# Altium project Control_Motor.PrjPcb
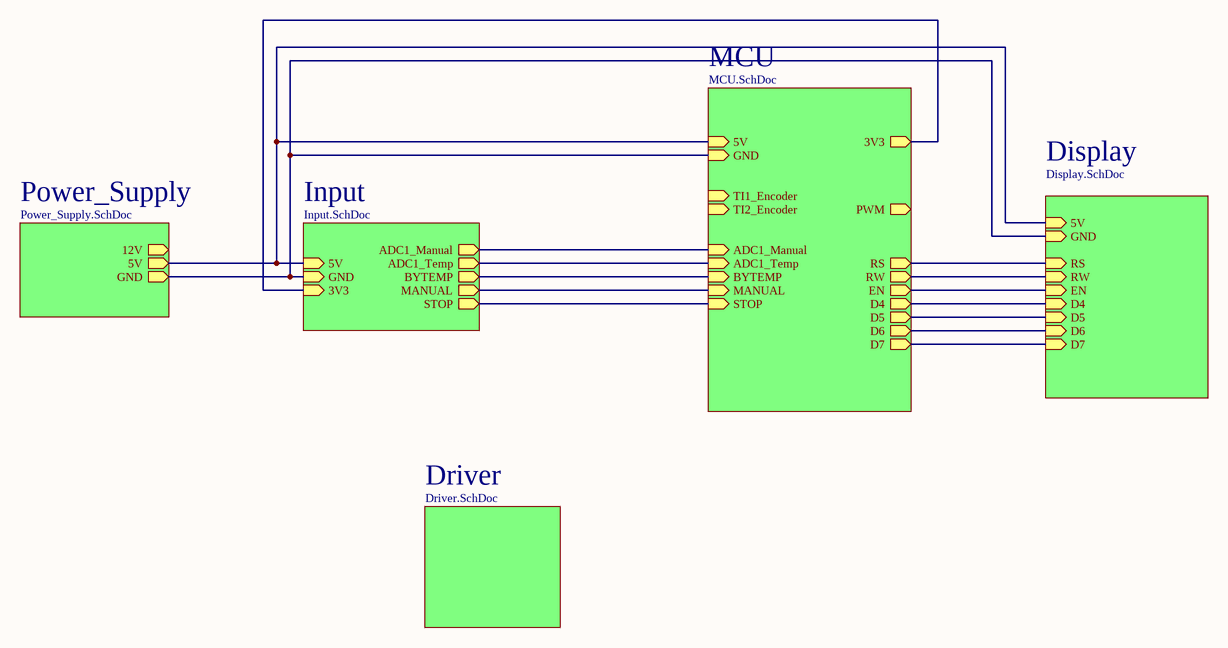
[diagram p0: Control_Motor.SchDoc]
6 sheets, 32 parts. Net scope: hierarchical (ports join the sheet entries above them; power ports are global).
Sheets:
  Control_Motor.SchDoc
    Power_Supply = Power_Supply.SchDoc
    Input = Input.SchDoc
    MCU = MCU.SchDoc
    Display = Display.SchDoc
    Driver = Driver.SchDoc

## Sheet Control_Motor.SchDoc: Control_Motor
size A4; SheetNumber: 1; SheetTotal: 6

### Sub-sheets
Display = Display.SchDoc: 5V (in), GND (in), RS (in), RW (in), EN (in), D4 (in), D5 (in), D6 (in), D7 (in)
Driver = Driver.SchDoc: no entries
Input = Input.SchDoc: 5V (in), GND (in), ADC1_Temp (out), BYTEMP (out), MANUAL (out), STOP (out), 3V3 (in), ADC1_Manual (out)
MCU = MCU.SchDoc: 5V (in), GND (in), TI1_Encoder (in), BYTEMP (in), TI2_Encoder (in), MANUAL (in), ADC1_Temp (in), STOP (in), ADC1_Manual (in), PWM (out), RS (out), RW (out), EN (out), D5 (out), D4 (out), D6 (out), D7 (out), 3V3 (out)
Power_Supply = Power_Supply.SchDoc: 12V (out), GND (out), 5V (out)

### Nets
3V3: sheet Input/3V3, sheet MCU/3V3
5V: sheet Power_Supply/5V, sheet Input/5V, sheet MCU/5V, sheet Display/5V
GND: sheet Power_Supply/GND, sheet Input/GND, sheet MCU/GND, sheet Display/GND
NetC?#5_2: sheet Input/BYTEMP, sheet MCU/BYTEMP
NetC?#6_2: sheet Input/MANUAL, sheet MCU/MANUAL
NetC?#7_2: sheet Input/STOP, sheet MCU/STOP
NetLCD?_4: sheet MCU/RS, sheet Display/RS
NetLCD?_5: sheet MCU/RW, sheet Display/RW
NetLCD?_6: sheet MCU/EN, sheet Display/EN
NetLCD?_11: sheet MCU/D4, sheet Display/D4
NetLCD?_12: sheet MCU/D5, sheet Display/D5
NetLCD?_13: sheet MCU/D6, sheet Display/D6
NetLCD?_14: sheet MCU/D7, sheet Display/D7
NetR?#2_2: sheet Input/ADC1_Temp, sheet MCU/ADC1_Temp
NetU*_29: sheet Input/ADC1_Manual, sheet MCU/ADC1_Manual

### Notes on the sheet
- Document Title:
- ĐH BKHN
- Project Name:
- Size:
- A4
- Reviewer:
- Designer:
- Nguyen Ba Hoang
- Revision:
- 1 Dai Co Viet Street
- Bach Khoa, Hai Ba Trung
- Ha Noi
- File:
- Sheet:
- of
- Date:

## Sheet Power_Supply.SchDoc: Power_Supply
size A4; SheetNumber: 2; SheetTotal: 5
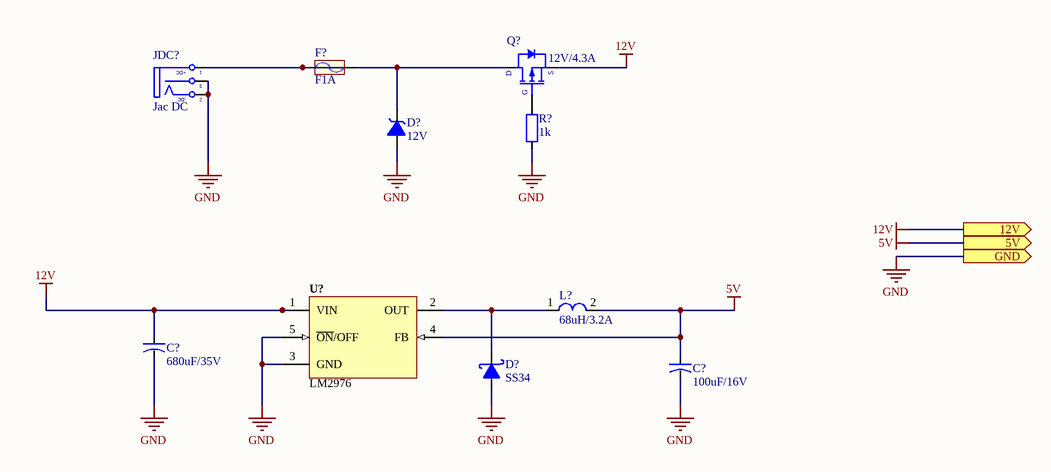
[diagram p1: Power_Supply.SchDoc]

### Parts
(Parts that share a designator on the sheet are numbered #1, #2 ... from top to bottom, then left to right.)
C?#1  680uF/35V  [CAP-ALU-SMD-H]
C?#2  100uF/16V  [CAP-ALU-SMD-6.3x7.7x2.2]
D?#1  12V  [SMA]
D?#2  SS34  [SMA]
F?  F1A  [RES-SMD-1812]
JDC?  Jac DC  [DC-IN]
L?  68uH/3.2A  [L-SMD-M-12x10]
Q?#1  12V/4.3A  [SOT23]
R?#1  1k  [RES-SMD-0805]
U?#1  LM2976  [TO263-5]

### Ports
5V (out), 12V (out), GND (out)

### Nets
5V: C?#2.1 L?.2 U?#1.4(FB) ; port 5V
12V: C?#1.1 Q?#1.3(S) U?#1.1(VIN) ; port 12V
GND: C?#1.2 C?#2.2 D?#1.1(A) D?#2.1(A) JDC?.2(TN) JDC?.3(S) R?#1.1 U?#1.3(GND) U?#1.5(~{ON}/OFF) ; port GND
NetD?#1_2: D?#1.2(K) F?.2 Q?#1.2(D)
NetD?#2_2: D?#2.2(K) L?.1 U?#1.2(OUT)
NetF?_1: F?.1 JDC?.1(T)
NetQ?#1_1: Q?#1.1(G) R?#1.2

### Notes on the sheet
- Document Title:
- ĐH BKHN
- Project Name:
- Size:
- A4
- Reviewer:
- Designer:
- Nguyen Ba Hoang
- Revision:
- 1 Dai Co Viet Street
- Bach Khoa, Hai Ba Trung
- Ha Noi
- File:
- Sheet:
- of
- Date:
- (in symbol DCIN) +DC; -DC

### Library data of the parts
C?#1 C?#2 = CAP-ALU-SMD: Polarized Capacitor (Axial)
  C?#1: Supplier: Thegioiic; Supplier Part Num: Tụ Nhôm SMD 680uF 35V 12.5x13.5mm
  C?#2: Published: 8-Jun-2000; LatestRevisionDate: 17-Jul-2002; LatestRevisionNote: Re-released for DXP Platform.; PackageReference: POLAR0.8; Publisher: Altium Limited
D?#1 = DZ: Diode TVS; Supplier: Thegioiic; Supplier Part Num: SMAJ12A
D?#2 = 1N5822: Schottky Rectifiers; Supplier: Thegioiic; Supplier Part Num: SS34 SMA Diode Schottky 3A
F? = Fuse: Supplier: Thegioiic; Supplier Part Num: MF-MSMF250/16 Cầu Chì Tự Phục Hồi 1812 16V 2.5A
JDC? = DCIN: Jac DC input; Available: *
L? = L-SMD-1: ComponentLink1Description: Manufacturer; ComponentLink1URL: http://www.we-online.de; ComponentLink2Description: Datasheet; ComponentLink2URL: http://katalog.we-online.de/pbs/datasheet/78477010.pdf; Supplier: Thegioiic; Supplier Part Num: Cuộn Cảm Dán SMD 1280-680 68uH 3.2A
Q?#1 = IRLML6401TRPBF: Supplier: Thegioiic; Supplier Part Num: IRLML6401TRPBF
R?#1 = Resistor - SMD: Resistor; Manufacturer: Generic Components; Class: Passive; Published: 08/06/2000; Publisher: Altium Hobart Technology Centre
U?#1 = LM2596: Supplier: Thegioiic; Supplier Part Num: LM2596S-5.0 IC Điều Chỉnh Giảm Áp 5V 3A TO-263-5

## Sheet Input.SchDoc: Input
size A4; SheetNumber: 3; SheetTotal: 5
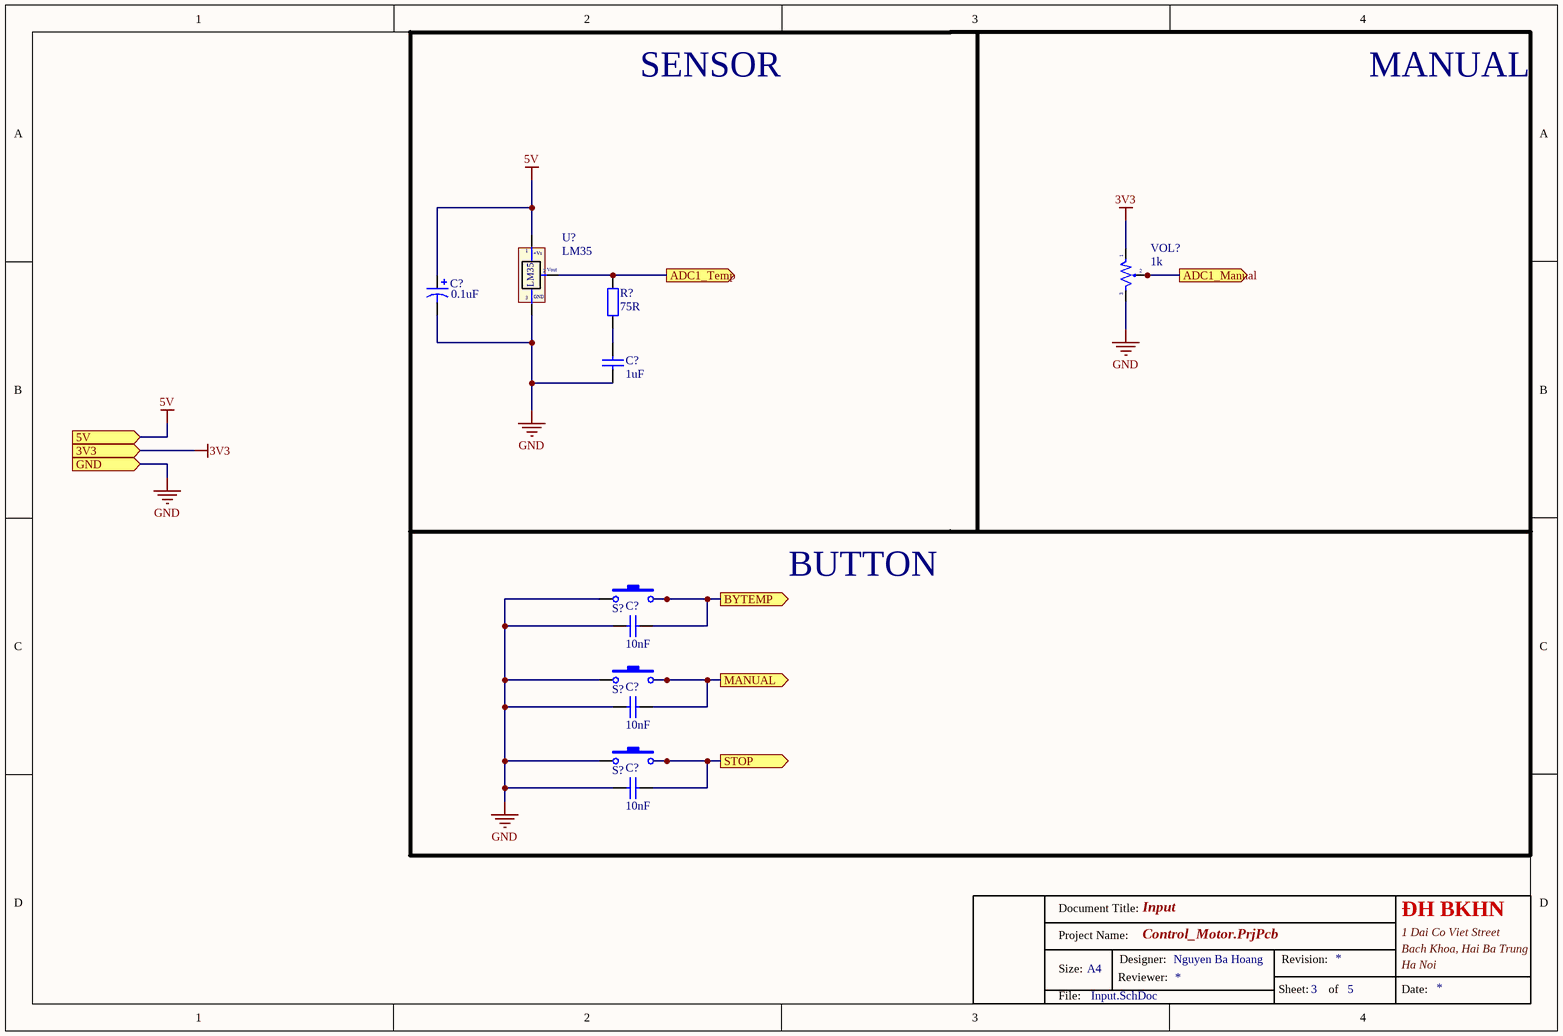
[diagram p2: Input.SchDoc]

### Parts
(Parts that share a designator on the sheet are numbered #1, #2 ... from top to bottom, then left to right.)
C?#3  0.1uF  [CAP-ALU-SMD-C]
C?#4  1uF  [CAP_0805]
C?#5  10nF  [CAP_0805]
C?#6  10nF  [CAP_0805]
C?#7  10nF  [CAP_0805]
R?#2  75R  [RES-SMD-0805]
S?#1  SW-SMD  [SW-SMD]  (value not drawn)
S?#2  SW-SMD  [SW-SMD]  (value not drawn)
S?#3  SW-SMD  [SW-SMD]  (value not drawn)
U?#2  LM35  [QTO-92]
VOL?  1k  [VOL_1]

### Ports
3V3 (in), 5V (in), ADC1_Manual (out), ADC1_Temp (out), BYTEMP (out), GND (in), MANUAL (out), STOP (out)

### Nets
3V3: VOL?.1 ; port 3V3
5V: C?#3.1 U?#2.1(+Vs) ; port 5V
GND: C?#3.2 C?#4.1 C?#5.1 C?#6.1 C?#7.1 S?#1.2 S?#2.2 S?#3.2 U?#2.3(-) VOL?.3 ; port GND
NetC?#4_2: C?#4.2 R?#2.1
NetC?#5_2: C?#5.2 S?#1.1 ; port BYTEMP
NetC?#6_2: C?#6.2 S?#2.1 ; port MANUAL
NetC?#7_2: C?#7.2 S?#3.1 ; port STOP
NetR?#2_2: R?#2.2 U?#2.2(Vout) ; port ADC1_Temp
NetU*_29: VOL?.2 ; port ADC1_Manual

### Notes on the sheet
- SENSOR
- MANUAL
- BUTTON
- Document Title:
- ĐH BKHN
- Project Name:
- Size:
- A4
- Reviewer:
- Designer:
- Nguyen Ba Hoang
- Revision:
- 1 Dai Co Viet Street
- Bach Khoa, Hai Ba Trung
- Ha Noi
- File:
- Sheet:
- of
- Date:
- (in symbol LM35) GND

### Library data of the parts
C?#3 = Cap Pol 5mm: Polarized Capacitor (Axial); Supplier: Thegioiic; Supplier Part Num: Tụ Nhôm SMD 0.1uF 50V 4x5.4mm
C?#4-C?#7 = CAP 102 2KV: Capacitor (Semiconductor SIM Model); Supplier: Thegioiic
  C?#4: Supplier Part Num: Tụ Gốm 0805 1uF 16V
  C?#5-C?#7: Supplier Part Num: Tụ Gốm 0805 10nF 50V
R?#2 = R1/4W: Resistor 1/4W; Supplier: Thegioiic; Supplier Part Num: Điện Trở 75 Ohm 0805 5%
S?#1-S?#3 = SW-SMD: Switch; Supplier: Thegioiic; Supplier Part Num: Nút Nhấn 3x6mm Cao 2.5mm 2 Chân SMD Đầu Trắng
U?#2 = LM35: Teminal; Available: *
VOL? = VOL-S: Var Resistor; Supplier: Thegioiic; Supplier Part Num: WH148-3P-102 Biến Trở Volume Đơn 1 KOhm 20% 0.125W 3 Chân

## Sheet MCU.SchDoc: MCU
size A4; SheetNumber: 4; SheetTotal: 6
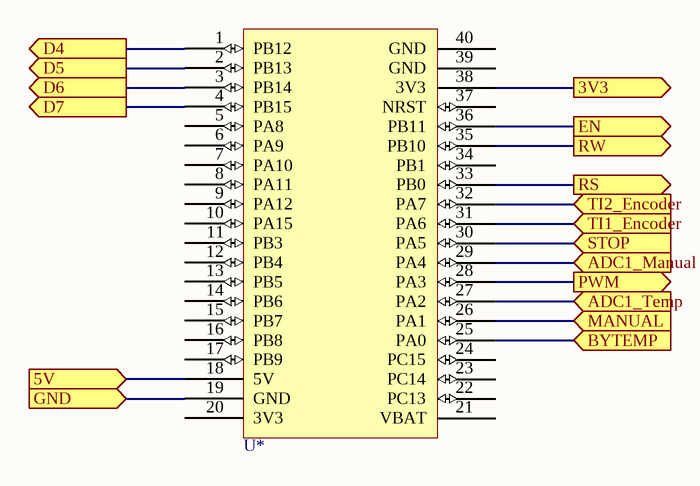
[diagram p3: MCU.SchDoc]

### Parts
U*  STM32 BluePill  [STM32 Bluepill]  (value not drawn)

### Ports
3V3 (out), 5V (in), ADC1_Manual (in), ADC1_Temp (in), BYTEMP (in), D4 (out), D5 (out), D6 (out), D7 (out), EN (out), GND (in), MANUAL (in), PWM (out), RS (out), RW (out), STOP (in), TI1_Encoder (in), TI2_Encoder (in)

### Nets
3V3: U*.38(3V3) ; port 3V3
5V: U*.18(5V) ; port 5V
GND: U*.19(GND) ; port GND
NetC?#5_2: U*.25(PA0) ; port BYTEMP
NetC?#6_2: U*.26(PA1) ; port MANUAL
NetC?#7_2: U*.30(PA5) ; port STOP
NetLCD?_4: U*.33(PB0) ; port RS
NetLCD?_5: U*.35(PB10) ; port RW
NetLCD?_6: U*.36(PB11) ; port EN
NetLCD?_11: U*.1(PB12) ; port D4
NetLCD?_12: U*.2(PB13) ; port D5
NetLCD?_13: U*.3(PB14) ; port D6
NetLCD?_14: U*.4(PB15) ; port D7
NetR?#2_2: U*.27(PA2) ; port ADC1_Temp
NetU*_28: U*.28(PA3) ; port PWM
NetU*_29: U*.29(PA4) ; port ADC1_Manual
NetU*_31: U*.31(PA6) ; port TI1_Encoder
NetU*_32: U*.32(PA7) ; port TI2_Encoder

Not connected (* = marked no-connect by the designer): U* 5(PA8) 6(PA9) 7(PA10) 8(PA11) 9(PA12) 10(PA15) 11(PB3) 12(PB4) 13(PB5) 14(PB6) 15(PB7) 16(PB8) 17(PB9) 20(3V3) 21(VBAT) 22(PC13) 23(PC14) 24(PC15) 34(PB1) 37(NRST) 39(GND) 40(GND)

### Notes on the sheet
- Document Title:
- ĐH BKHN
- Project Name:
- Size:
- A4
- Reviewer:
- Designer:
- Nguyen Ba Hoang
- Revision:
- 1 Dai Co Viet Street
- Bach Khoa, Hai Ba Trung
- Ha Noi
- File:
- Sheet:
- of
- Date:

### Library data of the parts
U* = STM32 BluePill: Available: *

## Sheet Display.SchDoc: Display
size A4; SheetNumber: 5; SheetTotal: 5
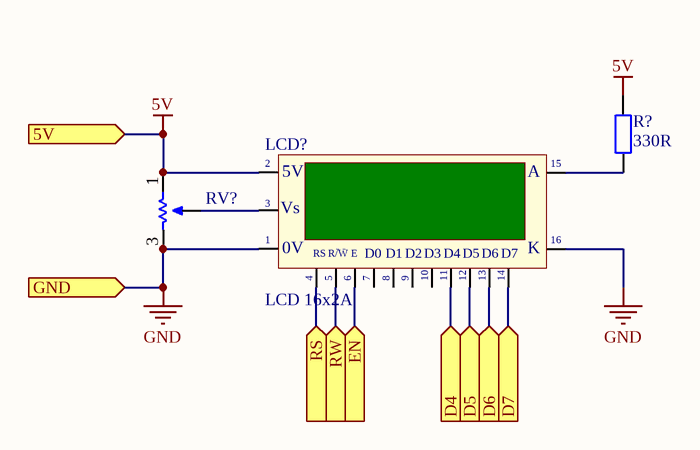
[diagram p4: Display.SchDoc]

### Parts
(Parts that share a designator on the sheet are numbered #1, #2 ... from top to bottom, then left to right.)
LCD?  LCD 16x2A  [LCD16X2]
R?#3  330R  [RES-SMD-0805]
RV?  RV20K  [RVAR10K]  (value not drawn)

### Ports
5V (in), D4 (in), D5 (in), D6 (in), D7 (in), EN (in), GND (in), RS (in), RW (in)

### Nets
5V: LCD?.2(VDD) R?#3.2 RV?.1 ; port 5V
GND: LCD?.1(GND) LCD?.16(K) RV?.3 ; port GND
NetLCD?_3: LCD?.3(VEE) RV?.2
NetLCD?_4: LCD?.4(RS) ; port RS
NetLCD?_5: LCD?.5(R/~{W}) ; port RW
NetLCD?_6: LCD?.6(~{EN}) ; port EN
NetLCD?_11: LCD?.11(D4) ; port D4
NetLCD?_12: LCD?.12(D5) ; port D5
NetLCD?_13: LCD?.13(D6) ; port D6
NetLCD?_14: LCD?.14(D7) ; port D7
NetLCD?_15: LCD?.15(A) R?#3.1

Not connected (* = marked no-connect by the designer): LCD? 7(D0) 8(D1) 9(D2) 10(D3)

### Notes on the sheet
- Document Title:
- ĐH BKHN
- Project Name:
- Size:
- A4
- Reviewer:
- Designer:
- Nguyen Ba Hoang
- Revision:
- 1 Dai Co Viet Street
- Bach Khoa, Hai Ba Trung
- Ha Noi
- File:
- Sheet:
- of
- Date:
- (in symbol LCD16x2A) 5V; Vs; |; 0V; R/W; E

### Library data of the parts
LCD? = LCD16x2A: LCD dipslay 16 char, 2 line; Available: *
R?#3 = R1/4W: Resistor 1/4W; Supplier Part Num: Điện Trở 330 Ohm 0805 5%
RV? = Variable Resistor: Available: *

## Sheet Driver.SchDoc: Driver
size A4; SheetNumber: 6; SheetTotal: 6
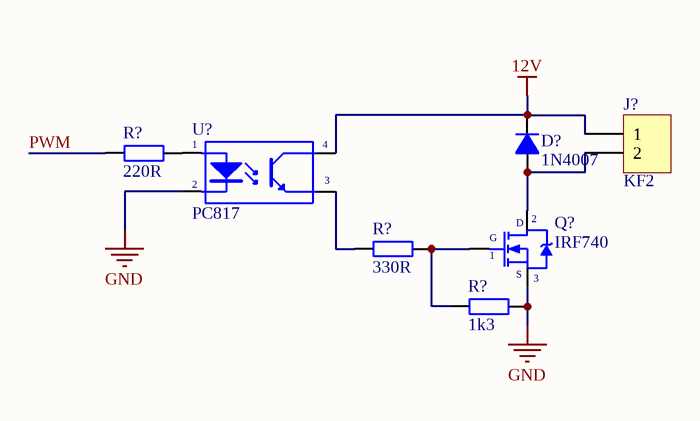
[diagram p5: Driver.SchDoc]

### Parts
(Parts that share a designator on the sheet are numbered #1, #2 ... from top to bottom, then left to right.)
D?#3  1N4007  [D1A]
J?  KF2  [KF2-3.5]
Q?#2  IRF740  [QTO-220]
R?#4  220R  [RES-SMD-0805]
R?#5  330R  [RES-SMD-0805]
R?#6  1k3  [RES-SMD-0805]
U?#3  PC817  [SMD-4]

### Nets
12V: D?#3.2(K) J?.1 U?#3.4(C)
GND: Q?#2.3(S) R?#6.2 U?#3.2(K)
PWM: R?#4.1
NetD?#3_1: D?#3.1(A) J?.2 Q?#2.2(D)
NetQ?#2_1: Q?#2.1(G) R?#5.1 R?#6.1
NetR?#4_2: R?#4.2 U?#3.1(A)
NetR?#5_2: R?#5.2 U?#3.3(E)

### Notes on the sheet
- Document Title:
- ĐH BKHN
- Project Name:
- Size:
- A4
- Reviewer:
- Designer:
- Nguyen Ba Hoang
- Revision:
- 1 Dai Co Viet Street
- Bach Khoa, Hai Ba Trung
- Ha Noi
- File:
- Sheet:
- of
- Date:

### Library data of the parts
D?#3 = D1A: Diode 1A; Value: 1N4007
J? = KF2: Manufacturer: Würth Elektronik eiSos GmbH; partNo: 691103110002; ComponentLink1 Description: Manufacturer; ComponentLink2 Description: Datasheet; NoPins: 2; Created Date: 29 October 2013; ComponentLink1URL: http://www.we-online.com; ComponentLink2URL: http://katalog.we-online.de/em/datasheet/6911031100xx.pdf; Created by: Karrer Zheng
Q?#2 = IRF840: MOSFET N - CHANNEL 500V - 0.75 - 8A - TO-220; Value: IRF840
R?#4-R?#6 = R1/4W: Resistor 1/4W
  R?#4: Supplier Part Num: Điện Trở 220 Ohm 0805 5%; Supplier: Thegioiic
  R?#5: Supplier Part Num: Điện Trở 330 Ohm 0805 5%
  R?#6: Supplier Part Num: Điện Trở 1.3 KOhm 0805 5%
U?#3 = PC817: Single Opto; Value: PC817; Parameter 1: *

## Nets that join several sheets
3V3: Input (VOL?.1), MCU (U*.38)
5V: Power_Supply (C?#2.1 L?.2 U?#1.4), Input (C?#3.1 U?#2.1), MCU (U*.18), Display (LCD?.2 R?#3.2 RV?.1)
12V: Power_Supply (C?#1.1 Q?#1.3 U?#1.1), Driver (D?#3.2 J?.1 U?#3.4)
GND: Power_Supply (9 pins), Input (10 pins), MCU (U*.19), Display (LCD?.1 LCD?.16 RV?.3), Driver (Q?#2.3 R?#6.2 U?#3.2)
NetC?#5_2: Input (C?#5.2 S?#1.1), MCU (U*.25)
NetC?#6_2: Input (C?#6.2 S?#2.1), MCU (U*.26)
NetC?#7_2: Input (C?#7.2 S?#3.1), MCU (U*.30)
NetLCD?_4: MCU (U*.33), Display (LCD?.4)
NetLCD?_5: MCU (U*.35), Display (LCD?.5)
NetLCD?_6: MCU (U*.36), Display (LCD?.6)
NetLCD?_11: MCU (U*.1), Display (LCD?.11)
NetLCD?_12: MCU (U*.2), Display (LCD?.12)
NetLCD?_13: MCU (U*.3), Display (LCD?.13)
NetLCD?_14: MCU (U*.4), Display (LCD?.14)
NetR?#2_2: Input (R?#2.2 U?#2.2), MCU (U*.27)
NetU*_29: Input (VOL?.2), MCU (U*.29)